# EAGLE design Motor_Surucu (EAGLE 9.6.2)
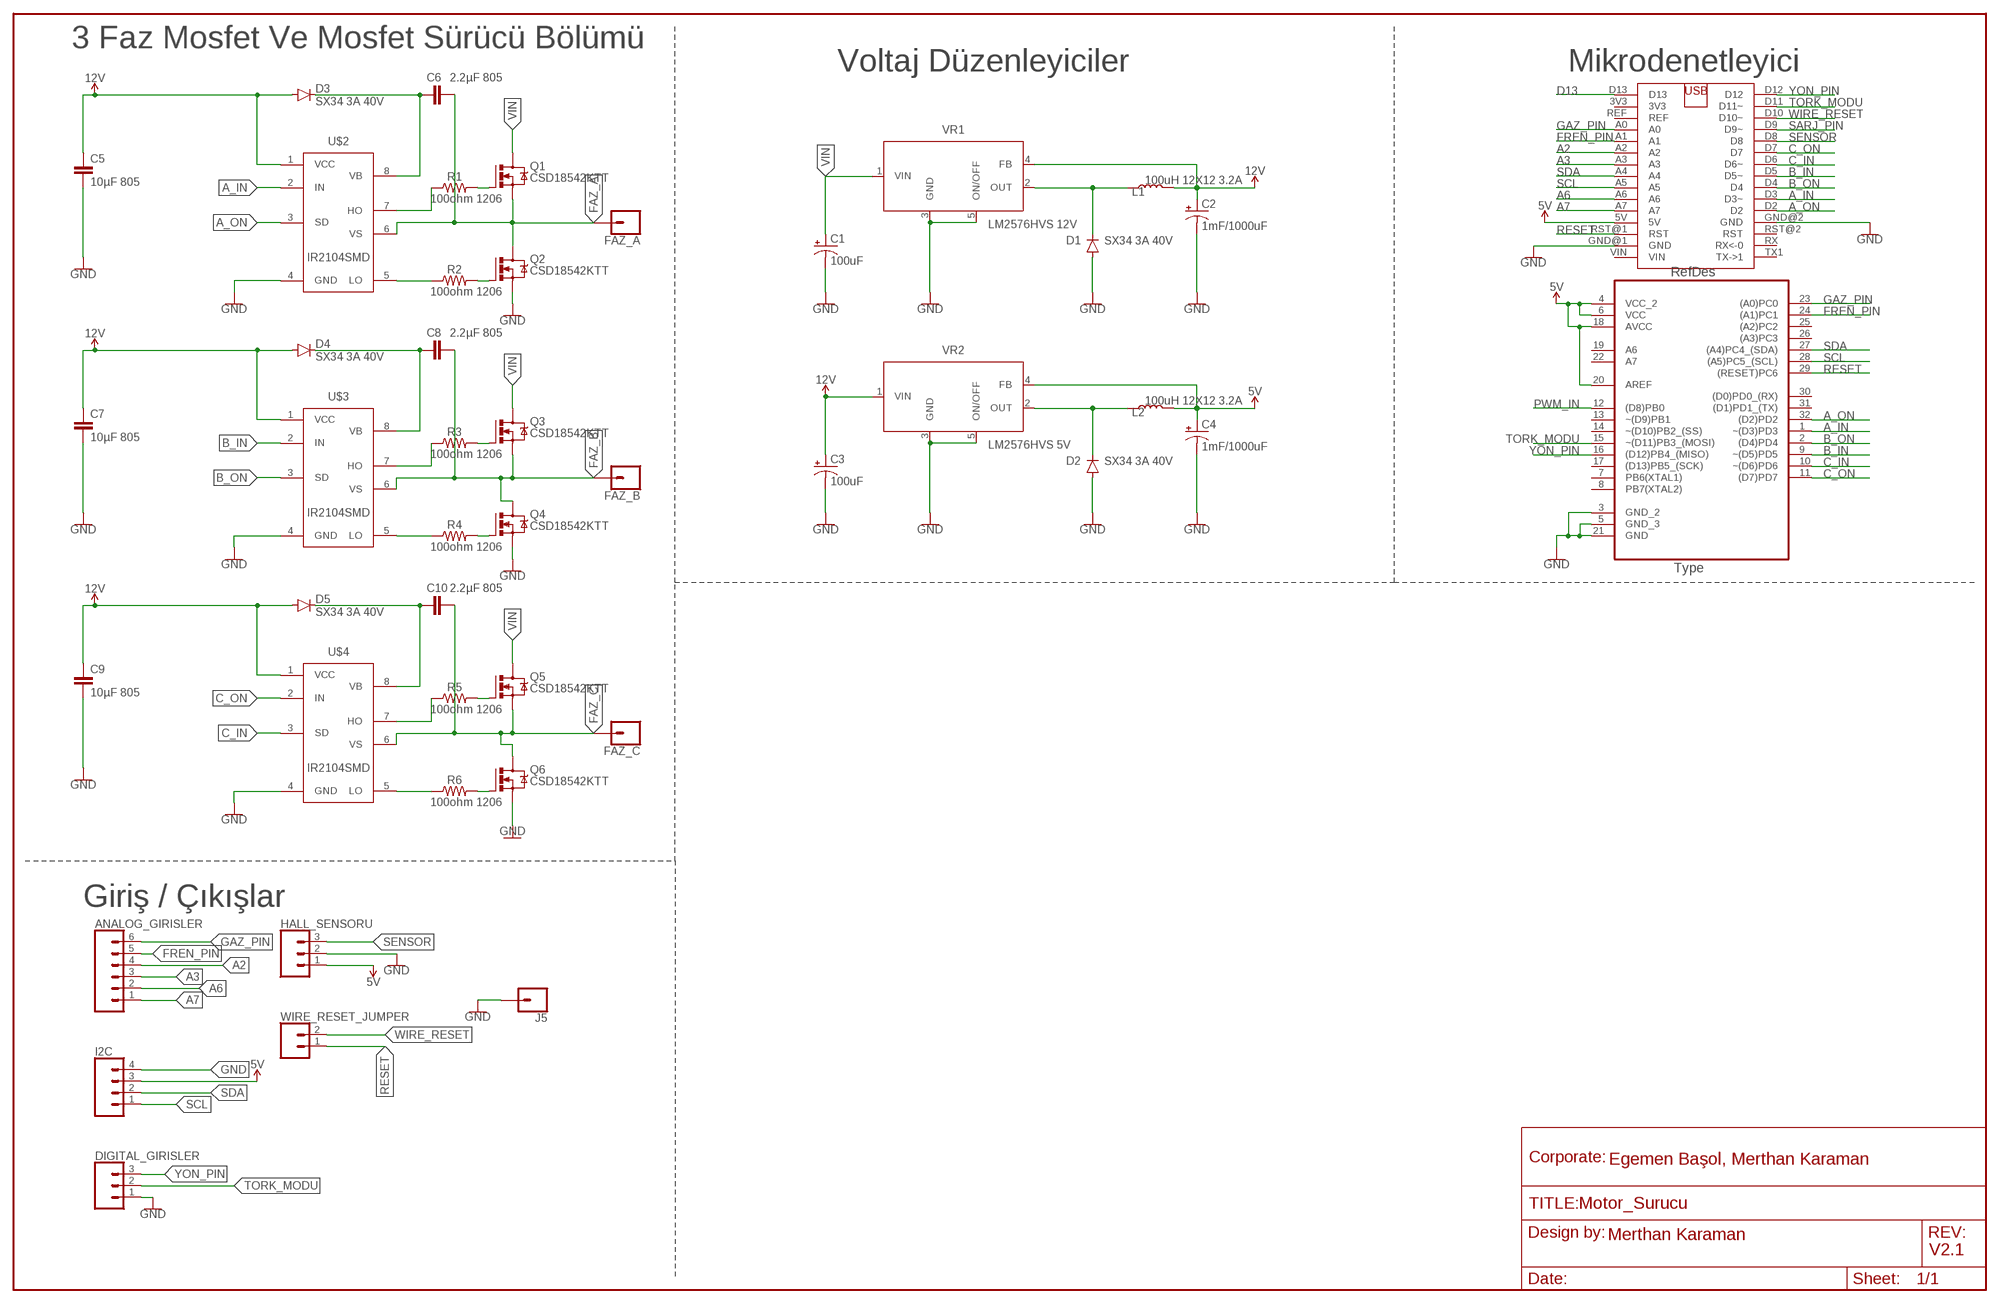
[diagram p0: schematic, sheet 1]
FRAME1 (FRAME-LEDGER): CORPO: Egemen Başol, Merthan Karaman; DESIGNER: Merthan Karaman; REV: V2.1

## Parts
ANALOG_GIRISLER  CONN_06LOCK  [1X06_LOCK]
C1  100uF  100UF-POLAR-RADIAL-2.5MM-25V-20%  [CPOL-RADIAL-2.5MM-6.5MM]
C2  1mF/1000uF  560UF-PANASONIC_G-25V-20%  [PANASONIC_G]
C3  100uF  100UF-POLAR-RADIAL-2.5MM-25V-20%  [CPOL-RADIAL-2.5MM-6.5MM]
C4  1mF/1000uF  560UF-PANASONIC_G-25V-20%  [PANASONIC_G]
C5  10µF 805  0.33UF/330NF-0805-50V-10%  [0805]
C6  2.2µF 805  0.33UF/330NF-0805-50V-10%  [0805]
C7  10µF 805  0.33UF/330NF-0805-50V-10%  [0805]
C8  2.2µF 805  0.33UF/330NF-0805-50V-10%  [0805]
C9  10µF 805  0.33UF/330NF-0805-50V-10%  [0805]
C10  2.2µF 805  0.33UF/330NF-0805-50V-10%  [0805]
D1  SX34 3A 40V  DIODE-DO214AC  [DO214AC]
D2  SX34 3A 40V  DIODE-DO214AC  [DO214AC]
D3  SX34 3A 40V  DIODE-DO214AC  [DO214AC]
D4  SX34 3A 40V  DIODE-DO214AC  [DO214AC]
D5  SX34 3A 40V  DIODE-DO214AC  [DO214AC]
DIGITAL_GIRISLER  CONN_03  [1X03]
FAZ_A  CONN_01SNAP-MALE  [SNAP-MALE]
FAZ_B  CONN_01SNAP-MALE  [SNAP-MALE]
FAZ_C  CONN_01SNAP-MALE  [SNAP-MALE]
HALL_SENSORU  CONN_03  [1X03]
I2C  CONN_04  [1X04]
J5  CONN_01SNAP-MALE  [SNAP-MALE]
L1  100uH 12X12 3.2A  INDUCTOR-SDR13-27UH  [INDUCTOR_SDR1307]
L2  100uH 12X12 3.2A  INDUCTOR-SDR13-27UH  [INDUCTOR_SDR1307]
Q1  CSD18542KTT  [TO263-3]
Q2  CSD18542KTT  [TO263-3]
Q3  CSD18542KTT  [TO263-3]
Q4  CSD18542KTT  [TO263-3]
Q5  CSD18542KTT  [TO263-3]
Q6  CSD18542KTT  [TO263-3]
R1  100ohm 1206  RESISTOR1206  [1206]
R2  100ohm 1206  RESISTOR1206  [1206]
R3  100ohm 1206  RESISTOR1206  [1206]
R4  100ohm 1206  RESISTOR1206  [1206]
R5  100ohm 1206  RESISTOR1206  [1206]
R6  100ohm 1206  RESISTOR1206  [1206]
U1  ATMEGA328P-AU  [QFP80P900X900X120-32N]
U$1  ARDUINO_NANO  [ARDUINO_NANO]
U$2  IR2104SMD  [SOIC-8]
U$3  IR2104SMD  [SOIC-8]
U$4  IR2104SMD  [SOIC-8]
VR1  LM2576HVS 12V  LM2576HVS-5.0/NOPBTO-263  [TO170P1435X465-6N]
VR2  LM2576HVS 5V  LM2576HVS-5.0/NOPBTO-263  [TO170P1435X465-6N]
WIRE_RESET_JUMPER  CONN_02  [1X02]

## Nets
5V: C4.+ HALL_SENSORU.1 I2C.3 L2.P$2 U1.4(VCC_2) U1.6(VCC) U1.18(AVCC) U1.20(AREF) U$1.5V VR2.4(FB)
12V: C2.+ C3.1(+) C5.1 C7.1 C9.1 D3.A D4.A D5.A L1.P$2 U$2.1(VCC) U$3.1(VCC) U$4.1(VCC) VR1.4(FB) VR2.1(VIN)
A2: ANALOG_GIRISLER.4 U$1.A2
A3: ANALOG_GIRISLER.3 U$1.A3
A6: ANALOG_GIRISLER.2 U$1.A6
A7: ANALOG_GIRISLER.1 U$1.A7
A_IN: U1.1(~(D3)PD3) U$1.D3(D3~) U$2.2(IN)
A_ON: U1.32((D2)PD2) U$1.D2 U$2.3(SD)
B_IN: U1.9(~(D5)PD5) U$1.D5(D5~) U$3.2(IN)
B_ON: U1.2((D4)PD4) U$1.D4 U$3.3(SD)
C_IN: U1.10(~(D6)PD6) U$1.D6(D6~) U$4.3(SD)
C_ON: U1.11((D7)PD7) U$1.D7 U$4.2(IN)
D13: U$1.D13
FAZ_A: C6.2 FAZ_A.2 Q1.3(S) Q2.TAB(D) U$2.6(VS)
FAZ_B: C8.2 FAZ_B.2 Q3.3(S) Q4.TAB(D) U$3.6(VS)
FAZ_C: C10.2 FAZ_C.2 Q5.3(S) Q6.TAB(D) U$4.6(VS)
FREN_PIN: ANALOG_GIRISLER.5 U1.24((A1)PC1) U$1.A1
GAZ_PIN: ANALOG_GIRISLER.6 U1.23((A0)PC0) U$1.A0
GND: C1.2(-) C2.- C3.2(-) C4.- C5.2 C7.2 C9.2 D1.A D2.A DIGITAL_GIRISLER.1 HALL_SENSORU.2 I2C.4 J5.2 Q2.3(S) Q4.3(S) Q6.3(S) U1.3(GND_2) U1.5(GND_3) U1.21(GND) U$1.GND@1(GND) U$1.GND@2(GND) U$2.4(GND) U$3.4(GND) U$4.4(GND) VR1.3(GND) VR1.5(ON/OFF) VR2.3(GND) VR2.5(ON/OFF)
N$1: D2.C L2.P$1 VR2.2(OUT)
N$4: C6.1 D3.C U$2.8(VB)
N$5: Q1.1(G) R1.2
N$6: R1.1 U$2.7(HO)
N$7: Q2.1(G) R2.2
N$8: R2.1 U$2.5(LO)
N$9: C8.1 D4.C U$3.8(VB)
N$10: Q3.1(G) R3.2
N$11: R3.1 U$3.7(HO)
N$12: Q4.1(G) R4.2
N$13: R4.1 U$3.5(LO)
N$14: C10.1 D5.C U$4.8(VB)
N$15: Q5.1(G) R5.2
N$16: R5.1 U$4.7(HO)
N$17: Q6.1(G) R6.2
N$18: R6.1 U$4.5(LO)
N$19: D1.C L1.P$1 VR1.2(OUT)
PWM_IN: U1.12((D8)PB0)
RESET: U1.29((RESET)PC6) U$1.RST@1(RST) WIRE_RESET_JUMPER.1
SARJ_PIN: U$1.D9(D9~)
SCL: I2C.1 U1.28((A5)PC5_(SCL)) U$1.A5
SDA: I2C.2 U1.27((A4)PC4_(SDA)) U$1.A4
SENSOR: HALL_SENSORU.3 U$1.D8
TORK_MODU: DIGITAL_GIRISLER.2 U1.15(~(D11)PB3_(MOSI)) U$1.D11(D11~)
VIN: C1.1(+) Q1.TAB(D) Q3.TAB(D) Q5.TAB(D) VR1.1(VIN)
WIRE_RESET: U$1.D10(D10~) WIRE_RESET_JUMPER.2
YON_PIN: DIGITAL_GIRISLER.3 U1.16((D12)PB4_(MISO)) U$1.D12
Unconnected: U1.7(PB6(XTAL1)) U1.8(PB7(XTAL2)) U1.13(~(D9)PB1) U1.14(~(D10)PB2_(SS)) U1.17((D13)PB5_(SCK)) U1.19(A6) U1.22(A7) U1.25((A2)PC2) U1.26((A3)PC3) U1.30((D0)PD0_(RX)) U1.31((D1)PD1_(TX)) U$1.3V3 U$1.REF U$1.RST@2(RST) U$1.RX(RX<-0) U$1.TX1(TX->1) U$1.VIN

## Notes on the sheet
- 3 Faz Mosfet Ve Mosfet Sürücü Bölümü
- Voltaj Düzenleyiciler | Mikrodenetleyici
- Giriş / Çıkışlar

## Library data of the parts
ANALOG_GIRISLER = SparkFun-Connectors:CONN_06: Multi connection point. Often used as Generic Header-pin footprint for 0.1 inch spaced/style header connections On any of the 0.1 inch spaced packages, you can populate with these: Break Away Headers - Straight <https://www.sparkfun.com/products/116> (PRT-00116) Break Away Male Headers - Right Angle <https://www.sparkfun.com/products/553> (PRT-00553) Female Headers <https://www.sparkfun.com/products/115> (PRT-00115) Break Away Headers - Machine Pin <https://www.sparkfun.com/products/117> (PRT-00117) Break Away Female Headers - Swiss Machine Pin <https://www.sparkfun.com/products/743> (PRT-00743) Arduino Stackable Header - 6 Pin <https://www.sparkfun.com/products/9280> (PRT-09280) For SCREWTERMINALS and SPRING TERMINALS visit here: Screw Terimnals on SparkFun.com <https://www.sparkfun.com/search/results?term=Screw+Terminals> (5mm/3.5mm/2.54mm spacing) This device is also useful as a general connection point to wire up your design to another part of your project. Our various solder wires solder well into these plated through hole pads. Hook-Up Wire - Assortment (Stranded, 22 AWG) <https://www.sparkfun.com/products/11375> (PRT-11375) Hook-Up Wire - Assortment (Solid Core, 22 AWG) <https://www.sparkfun.com/products/11367> (PRT-11367) View the entire wire category on our website here <https://www.sparkfun.com/categories/141>
C1 C3 = SparkFun-Capacitors:100UF-POLAR: 100µF polarized capacitors A capacitor is a passive two-terminal electrical component used to store electrical energy temporarily in an electric field.; PROD_ID: CAP-08439
C2 C4 = SparkFun-Capacitors:560UF: 560µF polarized capacitors A capacitor is a passive two-terminal electrical component used to store electrical energy temporarily in an electric field.; PROD_ID: CAP-09983; VALUE: 560uF
C5-C10 = SparkFun-Capacitors:0.33UF/330NF: 0.33µF/330nF ceramic capacitors A capacitor is a passive two-terminal electrical component used to store electrical energy temporarily in an electric field.; PROD_ID: CAP-08469; VALUE: 0.33µF
D1-D5 = diode:DIODE-: DIODE
DIGITAL_GIRISLER HALL_SENSORU = SparkFun-Connectors:CONN_03: Multi connection point. Often used as Generic Header-pin footprint for 0.1 inch spaced/style header connections On any of the 0.1 inch spaced packages, you can populate with these: Break Away Headers - Straight <https://www.sparkfun.com/products/116> (PRT-00116) Break Away Male Headers - Right Angle <https://www.sparkfun.com/products/553> (PRT-00553) Female Headers <https://www.sparkfun.com/products/115> (PRT-00115) Break Away Headers - Machine Pin <https://www.sparkfun.com/products/117> (PRT-00117) Break Away Female Headers - Swiss Machine Pin <https://www.sparkfun.com/products/743> (PRT-00743) Stackable Header - 3 Pin (Female, 0.1") <https://www.sparkfun.com/products/13875> (PRT-13875) For SCREWTERMINALS and SPRING TERMINALS visit here: Screw Terimnals on SparkFun.com <https://www.sparkfun.com/search/results?term=Screw+Terminals> (5mm/3.5mm/2.54mm spacing) This device is also useful as a general connection point to wire up your design to another part of your project. Our various solder wires solder well into these plated through hole pads. Hook-Up Wire - Assortment (Stranded, 22 AWG) <https://www.sparkfun.com/products/11375> (PRT-11375) Hook-Up Wire - Assortment (Solid Core, 22 AWG) <https://www.sparkfun.com/products/11367> (PRT-11367) View the entire wire category on our website here <https://www.sparkfun.com/categories/141> Special notes: Molex polarized connector foot print use with SKU : PRT-08232 with associated crimp pins and housings.
FAZ_A FAZ_B FAZ_C J5 = SparkFun-Connectors:CONN_01: Single connection point. Often used as Generic Header-pin footprint for 0.1 inch spaced/style header connections On any of the 0.1 inch spaced packages, you can populate with these: Break Away Headers - Straight <https://www.sparkfun.com/products/116> (PRT-00116) Break Away Male Headers - Right Angle <https://www.sparkfun.com/products/553> (PRT-00553) Female Headers <https://www.sparkfun.com/products/115> (PRT-00115) Break Away Headers - Machine Pin <https://www.sparkfun.com/products/117> (PRT-00117) Break Away Female Headers - Swiss Machine Pin <https://www.sparkfun.com/products/743> (PRT-00743) This device is also useful as a general connection point to wire up your design to another part of your project. Our various solder wires solder well into these plated through hole pads. Hook-Up Wire - Assortment (Stranded, 22 AWG) <https://www.sparkfun.com/products/11375> (PRT-11375) Hook-Up Wire - Assortment (Solid Core, 22 AWG) <https://www.sparkfun.com/products/11367> (PRT-11367) View the entire wire category on our website here <https://www.sparkfun.com/categories/141> Special notes: SMTSO-256-ET is a "flush mount" nut for a 4-40 screw. We mostly use this on specialty testbeds; it is a nice way to connect hardware to your PCB at an adjustable hieght. Also note, the SNAP packages are for using a snappable style connector. We sell a baggie of snaps and they are also used on two LilyPad designs: Snap Assortment - 30 pack (male and female) <https://www.sparkfun.com/products/11347> (DEV-11347) LilyPad Arduino SimpleSnap <https://www.sparkfun.com/products/10941> (DEV-10941) LilyPad SimpleSnap Protoboard <https://www.sparkfun.com/products/10940> (DEV-10940)
I2C = SparkFun-Connectors:CONN_04: Multi connection point. Often used as Generic Header-pin footprint for 0.1 inch spaced/style header connections On any of the 0.1 inch spaced packages, you can populate with these: Break Away Headers - Straight <https://www.sparkfun.com/products/116> (PRT-00116) Break Away Male Headers - Right Angle <https://www.sparkfun.com/products/553> (PRT-00553) Female Headers <https://www.sparkfun.com/products/115> (PRT-00115) Break Away Headers - Machine Pin <https://www.sparkfun.com/products/117> (PRT-00117) Break Away Female Headers - Swiss Machine Pin <https://www.sparkfun.com/products/743> (PRT-00743) For SCREWTERMINALS and SPRING TERMINALS visit here: Screw Terimnals on SparkFun.com <https://www.sparkfun.com/search/results?term=Screw+Terminals> (5mm/3.5mm/2.54mm spacing) This device is also useful as a general connection point to wire up your design to another part of your project. Our various solder wires solder well into these plated through hole pads. Hook-Up Wire - Assortment (Stranded, 22 AWG) <https://www.sparkfun.com/products/11375> (PRT-11375) Hook-Up Wire - Assortment (Solid Core, 22 AWG) <https://www.sparkfun.com/products/11367> (PRT-11367) View the entire wire category on our website here <https://www.sparkfun.com/categories/141> Special notes: Molex polarized connector foot print use with SKU : PRT-08231 with associated crimp pins and housings. 1MM SMD Version SKU: PRT-10208; PROD_ID: CONN-09696
L1 L2 = SparkFun-Coils:INDUCTOR: Inductors Resist changes in electrical current. Basically a coil of wire. SparkFun Products: SparkFun Load Cell Amplifier - HX711 <https://www.sparkfun.com/products/13879> IOIO-OTG - V2.2 <https://www.sparkfun.com/products/13613>; PROD_ID: NDUC-12529; VALUE: 27µH/±20%/3.3A
Q1-Q6 = El_yapimi:CSD18542KTT
R1-R6 = SparkFun-Resistors:RESISTOR: Generic Resistor Package
U1 = El_yapimi:ATMEGA328P-AU; DESCRIPTION: 8-bit Microcontroller with In-System Programmable Flash; MPN: ATMEGA328P-AU; OC_FARNELL: 1715486; OC_NEWARK: 14R4631; PACKAGE: TQFP-32; SUPPLIER: Atmel
U$1 = El_yapimi:ARDUINO_NANO
U$2-U$4 = El_yapimi:IR2104SMD
VR1 VR2 = IC_Power-Management:LM2576HVS-5.0/NOPB: SIMPLE SWITCHER® 3-A Step-Down Voltage Regulator Datasheet <http://www.ti.com/lit/ds/symlink/lm2576hv.pdf>; CATEGORY: IC_Power-Management; MANUFACTURER: TI; MPN: LM2576HVS-5.0/NOPB; OPERATING_TEMP: -40 to +125 °C; PART_STATUS: Active; ROHS_COMPLIANT: Non Compliant; SERIES: LM2576xx; SUB-CATEGORY: Voltage Regulator; TYPE: DC-DC Switching; VALUE: LM2576HVS
WIRE_RESET_JUMPER = SparkFun-Connectors:CONN_02: Multi connection point. Often used as Generic Header-pin footprint for 0.1 inch spaced/style header connections On any of the 0.1 inch spaced packages, you can populate with these: Break Away Headers - Straight <https://www.sparkfun.com/products/116> (PRT-00116) Break Away Male Headers - Right Angle <https://www.sparkfun.com/products/553> (PRT-00553) Female Headers <https://www.sparkfun.com/products/115> (PRT-00115) Break Away Headers - Machine Pin <https://www.sparkfun.com/products/117> (PRT-00117) Break Away Female Headers - Swiss Machine Pin <https://www.sparkfun.com/products/743> (PRT-00743) For SCREWTERMINALS and SPRING TERMINALS visit here: Screw Terimnals on SparkFun.com <https://www.sparkfun.com/search/results?term=Screw+Terminals> (5mm/3.5mm/2.54mm spacing) This device is also useful as a general connection point to wire up your design to another part of your project. Our various solder wires solder well into these plated through hole pads. Hook-Up Wire - Assortment (Stranded, 22 AWG) <https://www.sparkfun.com/products/11375> (PRT-11375) Hook-Up Wire - Assortment (Solid Core, 22 AWG) <https://www.sparkfun.com/products/11367> (PRT-11367) View the entire wire category on our website here <https://www.sparkfun.com/categories/141> Special notes: Molex polarized connector foot print use with: PRT-08233 with associated crimp pins and housings. 2.54_SCREWTERM for use with PRT-10571. 3.5mm Screw Terminal footprints for PRT-08084 5mm Screw Terminal footprints for use with PRT-08432

## Board
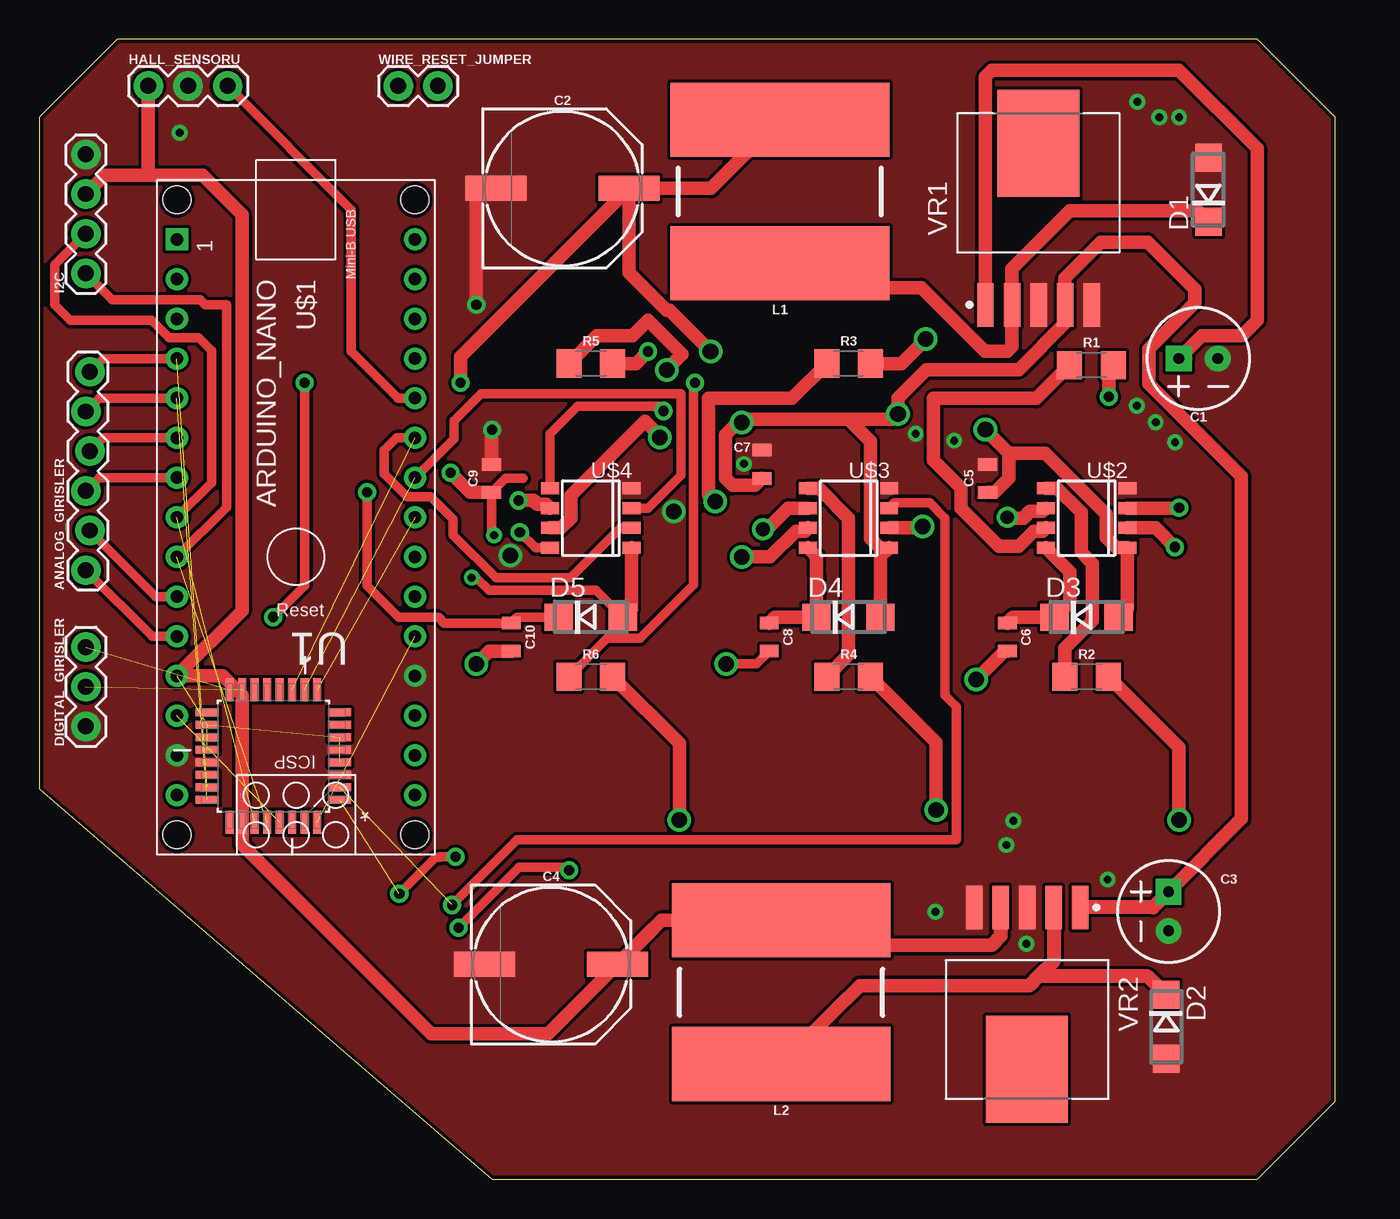
[diagram p1: board, top side]
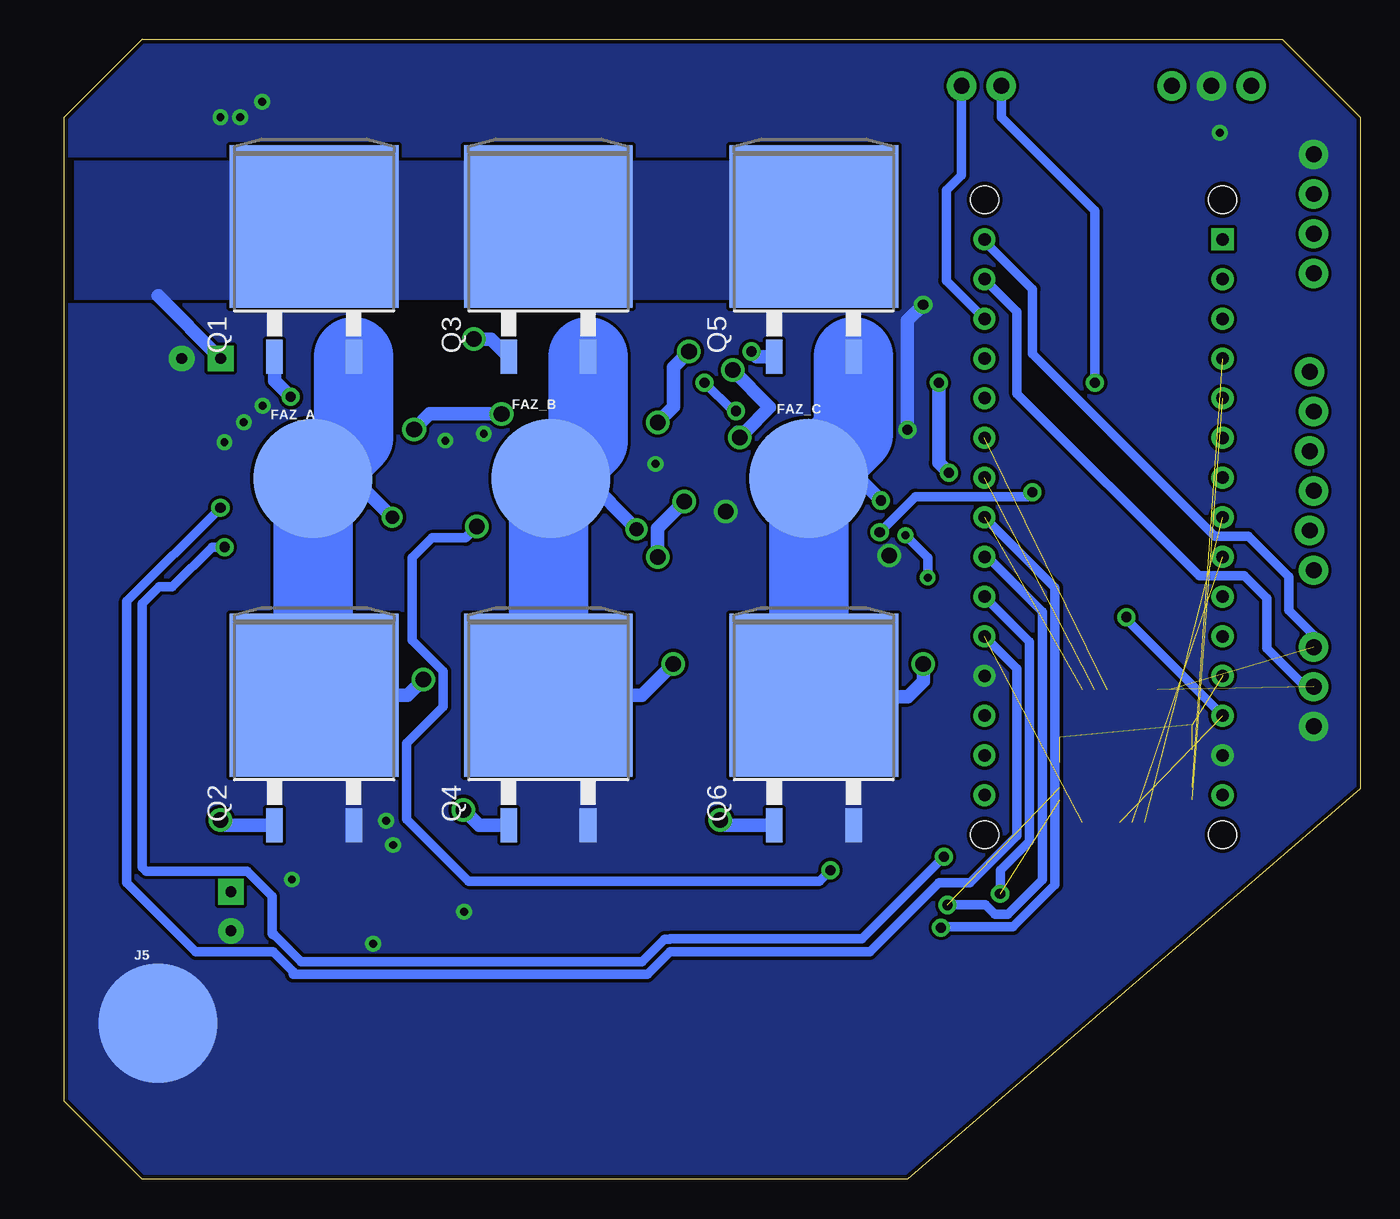
[diagram p2: board, bottom side, seen from below]

Size 83 x 73 mm. Coordinates in mm from the lower left corner, seen from the top.
Outline: 78,73 5,73 0,68 0,25 29,0 78,0 83,5 83,68 78,73
Copper layers (1*16): Top 0.035mm / dielectric 1.5mm / Bottom 0.035mm
Design rules "SparkFun": minimum track width 8mil, minimum drill 20mil, track to track 8mil, track to pad 8mil, pad to pad 8mil, via to via 8mil, smd to smd 8mil, copper to edge 10mil, drill to drill 8mil, minimum pad ring 12mil, minimum via ring 10mil, stop-mask expansion 4mil, vias tented up to drill 25mil, thermal gap 10mil

### Footprints (pad centres in the part's own frame; a part is rotated, then mirrored left to right if it is on the bottom)
1X06_LOCK = drill 1.016 pad 1.88: 1 0,0; 2 2.54,-0.254; 3 5.08,0; 4 7.62,-0.254; 5 10.16,0; 6 12.7,-0.254
CPOL-RADIAL-2.5MM-6.5MM = drill 0.7 pad 1.651 square: 1 1.25,0 | drill 0.7 pad 1.651: 2 -1.25,0
PANASONIC_G = smd 3.9 x 1.6: + 4.25,0; - -4.25,0
0805 = smd 0.8 x 1.2: 1 -0.9,0; 2 0.9,0
DO214AC = smd 1.8 x 1.7: A 2.05,0; C -2.05,0
1X03 = drill 1.016 pad 1.88: 1 0,0; 2 2.54,0; 3 5.08,0
SNAP-MALE = smd 7.62 x 7.62: 2 0,0
1X04 = drill 1.016 pad 1.88: 1 0,0; 2 2.54,0; 3 5.08,0; 4 7.62,0
INDUCTOR_SDR1307 = smd 14 x 4.75: P$1 0,4.6; P$2 0,-4.6
TO263-3 = smd 1.067 x 2.159: 1 -2.54,-8.331; 3 2.54,-8.331 | smd 10.8 x 10.41: TAB 0,0
1206 = smd 1.6 x 1.8: 1 -1.4,0; 2 1.4,0
QFP80P900X900X120-32N = smd 1.473 x 0.508: 1 -4.242,2.794; 2 -4.242,2.007; 3 -4.242,1.194; 4 -4.242,0.406; 5 -4.242,-0.406; 6 -4.242,-1.194; 7 -4.242,-2.007; 8 -4.242,-2.794; 17 4.242,-2.794; 18 4.242,-2.007; 19 4.242,-1.194; 20 4.242,-0.406; 21 4.242,0.406; 22 4.242,1.194; 23 4.242,2.007; 24 4.242,2.794 | smd 0.508 x 1.473: 9 -2.794,-4.242; 10 -2.007,-4.242; 11 -1.194,-4.242; 12 -0.406,-4.242; 13 0.406,-4.242; 14 1.194,-4.242; 15 2.007,-4.242; 16 2.794,-4.242; 25 2.794,4.242; 26 2.007,4.242; 27 1.194,4.242; 28 0.406,4.242; 29 -0.406,4.242; 30 -1.194,4.242; 31 -2.007,4.242; 32 -2.794,4.242
ARDUINO_NANO = drill 0.8: 3V3 -7.62,13.97; 5V -7.62,-11.43; A0 -7.62,8.89; A1 -7.62,6.35; A2 -7.62,3.81; A3 -7.62,1.27; A4 -7.62,-1.27; A5 -7.62,-3.81; A6 -7.62,-6.35; A7 -7.62,-8.89; D2 7.62,-8.89; D3 7.62,-6.35; D4 7.62,-3.81; D5 7.62,-1.27; D6 7.62,1.27; D7 7.62,3.81; D8 7.62,6.35; D9 7.62,8.89; D10 7.62,11.43; D11 7.62,13.97; D12 7.62,16.51; GND@1 -7.62,-16.51; GND@2 7.62,-11.43; REF -7.62,11.43; RST@1 -7.62,-13.97; RST@2 7.62,-13.97; RX 7.62,-16.51; TX1 7.62,-19.05; VIN -7.62,-19.05 | drill 0.8 square: D13 -7.62,16.51 | hole 1.778: -7.62,19.05; 7.62,19.05; 7.62,-21.59; -7.62,-21.59
SOIC-8 = smd 0.762 x 1.143: 1 -1.905,-2.6; 2 -0.635,-2.6; 3 0.635,-2.6; 4 1.905,-2.6; 5 1.905,2.6; 6 0.635,2.6; 7 -0.635,2.6; 8 -1.905,2.6
TO170P1435X465-6N = smd 2.792 x 1.053: 1 -6.185,3.4; 2 -6.185,1.7; 3 -6.185,0; 4 -6.185,-1.7; 5 -6.185,-3.4 | smd 6.842 x 5.252: 6 4.16,0
1X02 = drill 1.016 pad 1.88: 1 0,0; 2 2.54,0

### Placement (x,y rotation side)
ANALOG_GIRISLER  3,39 90 top
C1  74.24,52.55 180 top
C2  33.52,63.44 0 top
C3  72.33,17.16 90 top
C4  32.79,13.77 0 top
C5  60.73,44.88 90 top
C6  62,34.72 270 top
C7  46.29,45.78 90 top
C8  46.76,34.72 270 top
C9  28.98,44.88 90 top
C10  30.25,34.72 270 top
D1  74.89,63.36 90 top
D2  72.16,9.78 270 top
D3  67.08,35.99 0 top
D4  51.84,35.99 0 top
D5  35.33,35.99 0 top
DIGITAL_GIRISLER  3,29 90 top
FAZ_A  67.08,44.88 0 bottom
FAZ_B  51.84,44.88 0 bottom
FAZ_C  35.33,44.88 0 bottom
HALL_SENSORU  7,70 0 top
I2C  3,58 90 top
J5  77,10 0 bottom
L1  47.44,63.24 180 top
L2  47.52,11.99 180 top
Q1  67,61 0 bottom
Q2  67,31 0 bottom
Q3  52,61 0 bottom
Q4  52,31 0 bottom
Q5  35,61 0 bottom
Q6  35,31 0 bottom
R1  67.38,52.13 0 top
R2  67.08,32.18 0 top
R3  51.84,52.23 0 top
R4  51.84,32.18 0 top
R5  35.33,52.23 0 top
R6  35.33,32.18 0 top
U1  15.01,27.1 180 top
U$1  16.45,43.66 0 top
U$2  67.08,42.34 90 top
U$3  51.84,42.34 90 top
U$4  35.33,42.34 90 top
VR1  64,62.17 90 top
VR2  63.27,11.23 270 top
WIRE_RESET_JUMPER  23,70 0 top

### Tracks (layer width: path | path; a pad name or v marks a point on that pad's centre or on a via)
5V  (4 unrouted)
  Top 0.864: 7,64.28 4.2,64.28 I2C.3 | 7,64.28 10.48,64.28 13,61.77 13,36.4 U$1.5V 11.77,32.23 13,31 13,21.44 25.12,9.32 32.58,9.32 C4.+ | HALL_SENSORU.1 7,64.28 | 61,15 49.11,15 L2.P$2 39.85,16.59 39.26,16
  Top 0.889: VR2.4 61.57,15.57 61,15 | C4.+ 37.77,14.5 39.26,16
12V  (via drill 0.51, 0.65, 1)
  Top 0.61: 31,44.88 29.88,44.88 C9.1 28.98,41.4 v29.14,41.23 | v27.71,38.53 27.99,38.53 28.82,37.7 35.67,37.7 D5.A
  Top 0.864: L1.P$2 43.04,63.44 C2.+ | C2.+ 27,52.67 v27,51 | v26.36,45.23 27.61,43.98 C9.1 | v43,53 40.37,55.63 40.18,55.63 37.77,58.04 C2.+ | 51.84,48.66 54.66,48.66 v55,49 55,50 56.84,51.84 62.74,51.84 65.7,54.8 VR1.4 65.7,57.7 68,60 71,60 74,57 74,56.11 71.07,53.18 71.07,50.93 77,45 77,23.08 C3.1 | 51.84,48.66 45.2,48.66 v45,48.46 44.75,48.46 43.96,47.67 43.96,44.87 44.4,44.43 45.84,44.43 C7.1 | 62.1,46.5 62.1,44.88 61.2,43.98 C5.1 | v60.6,48 62.1,46.5 | 62.1,46.5 64.44,46.5 68.35,42.59 68.35,41.07 68.99,40.44 U$2.1 69.68,36.54 D3.A | D4.A 53.89,39.88 | 53.89,39.88 U$3.1 | 53.89,39.88 53.89,40.4 53.23,41.06 53.23,47.27 51.84,48.66 | D5.A 37.93,36.54 U$4.1
  Top 0.889: C3.1 71.34,17.43 VR2.1
  Bottom 0.61: v27.71,38.53 27.71,39.8 v29.14,41.23
  Bottom 0.864: v27,51 27,45.87 v26.36,45.23 | v43,53 44,52 44,49.46 v45,48.46 | v55,49 59.6,49 v60.6,48
A2
  Top 0.61: ANALOG_GIRISLER.4 4.1,47.47 U$1.A2
A3
  Top 0.61: ANALOG_GIRISLER.3 3.85,44.93 U$1.A3
A6
  Top 0.61: ANALOG_GIRISLER.2 7.48,37.31 U$1.A6
A7
  Top 0.61: ANALOG_GIRISLER.1 7.23,34.77 U$1.A7
A_IN  (via drill 0.65)  (1 unrouted)
  Top 0.61: v23.07,18.29 25.4,20.62 25.67,20.62 25.7,20.65 v26.68,20.65
  Top 0.864: U$2.2 71.51,41.7 v72.74,40.48
  Bottom 0.61: v26.68,20.65 31.94,15.4 44.22,15.4 44.23,15.39 44.56,15.39 46,13.94 67.84,13.94 69.56,15.67 69.62,15.67 69.69,15.74 69.69,18.14 71.29,19.74 77.74,19.74 78,20 78,36.85 76.93,37.92 76.07,37.92 73.52,40.48 v72.74,40.48 | v23.07,18.29 23.07,19.78 21.19,21.66 21.19,34.43 U$1.D3
A_ON  (via drill 0.65)  (1 unrouted)
  Top 0.864: v73,43 72.97,42.98 U$2.3
  Bottom 0.61: v73,43 79,37 79,19 74.58,14.58 69.62,14.58 68.35,13.31 68.35,13.13 45.67,13.13 44.22,14.58 31.42,14.58 27,19 25,19 22,22 22,32.7 U$1.D2
B_IN  (via drill 0.65, 1)  (1 unrouted)
  Top 0.61: v26.86,16.12 30.74,20 33.94,20 v33.94,19.8
  Top 0.864: U$3.2 56.5,41.7 v56.58,41.79
  Bottom 0.61: U$1.D5 19.56,37.88 19.56,18.85 22.24,16.17 26.81,16.17 v26.86,16.12 | v33.94,19.8 34.65,19.09 57.11,19.09 61.07,23.05 61.07,27.93 58.74,30.26 58.74,32.52 60.73,34.52 60.73,39.8 59.46,41.07 57.3,41.07 v56.58,41.79
B_ON  (via drill 0.65)  (1 unrouted)
  Top 0.61: v26.44,17.57 30.61,21.74 58.73,21.74 58.73,30.27 58.02,30.98 58.02,42.34 57.05,43.3 54.77,43.3 U$3.3
  Bottom 0.61: U$1.D4 23.89,39.85 20.37,36.33 20.37,19.19 22.58,16.98 23.42,16.98 24.01,17.57 v26.44,17.57
C_IN  (1 unrouted)
  Top 0.61: U$1.D6 26.57,47.43 26.57,48.57 28.3,50.3 41.1,50.3 41.1,45.09 38.99,42.98 U$4.3
C_ON  (1 unrouted)
  Top 0.61: U$1.D7 22.89,47.47 22.1,46.68 22.1,45.18 23.57,43.72 25.06,43.72 26.52,42.26 26.52,41.25 29.25,38.52 34.05,38.52 37.23,41.7 U$4.2
FAZ_A  (via drill 0.85, 1)
  Top 0.61: 62.05,42.34 v62,42.39
  Top 0.864: C6.2 61.82,33.82 v60,32 | U$2.6 64.28,42.77 63.46,42.77 63.03,42.34 62.05,42.34
  Bottom 0.864: FAZ_A.2 64.49,44.88 v62,42.39 | Q2.TAB 61,31 v60,32
  Bottom 5.08: Q1.3 64.46,47.5 FAZ_A.2 67.08,31.08 Q2.TAB
FAZ_B  (via drill 0.9, 1)
  Top 0.61: C8.2 45.94,33 v44,33
  Top 0.864: v46.35,41.63 46.62,41.63 47.97,42.98 U$3.6
  Bottom 0.864: FAZ_B.2 49.61,44.88 v46.35,41.63 | Q4.TAB 46,31 v44,33
  Bottom 5.08: Q3.3 49.46,47.26 FAZ_B.2 52,44.72 Q4.TAB
FAZ_C  (via drill 0.65, 1)
  Top 0.864: C10.2 28.82,33.82 v28,33 | v30.71,43.46 31.66,43.46 31.89,43.23 32.48,43.23 U$4.6
  Bottom 0.864: FAZ_C.2 32.12,44.88 v30.71,43.46 | Q6.TAB 34.91,30.91 28.98,30.91 28,31.89 v28,33
  Bottom 5.08: Q6.TAB 35.33,31.33 FAZ_C.2 32.46,47.75 Q5.3
FREN_PIN  (1 unrouted)
  Top 0.61: ANALOG_GIRISLER.5 3.85,50.01 U$1.A1
GAZ_PIN  (1 unrouted)
  Top 0.61: ANALOG_GIRISLER.6 4.1,52.55 U$1.A0
GND  (via drill 0.51, 0.65, 1)
  Top 0.864: C9.2 28.98,47.98 v29,48 | v28,56 28,63
  Bottom 0.864: v29,48 29,55 v28,56
  other vias: 58.6,47.3 40.65,42.75 73,68 9,67 45.15,45.8 56.13,47.72 61.95,21.41 62.38,22.96 68.43,19.2 71.73,68 70.33,68.98 57.4,17.14 63.22,15.09 70.31,49.53 71.5,48.46 72.74,47.19 30.19,39.93
  pour Top (rank 3, no thermals): -10.85,78.3 -10.85,-2.7 89.21,-2.7 89.21,78.3
  pour Bottom (rank 3, no thermals): -15.01,82 -15,-6 93,-6 93.01,82
N$1
  Top 0.864: 63.42,12.42 52.56,12.42 51.72,11.58 L2.P$1
  Top 0.889: VR2.2 64.97,13.97 64,13 | 64,13 63.42,12.42 | D2.C 70.99,13 64,13
N$4
  Top 0.864: C6.1 62.37,35.99 D3.C 66,36.96 66,38.91 U$2.8
N$5  (via drill 0.65)
  Top 0.864: R1.2 68.5,51.85 v68.5,50.1
  Bottom 0.864: v68.5,50.1 69.54,51.14 Q1.1
N$6
  Top 0.864: R1.1 63.85,50 57.28,50 57.28,46.05 59.04,44.29 59.04,42.96 61.47,40.53 62.73,40.53 63.7,41.5 64.28,41.5 U$2.7
N$7  (via drill 1)
  Top 0.864: R2.2 73,27.66 v73,23
  Bottom 0.864: v73,23 72.67,22.67 Q2.1
N$8
  Top 0.864: U$2.5 65.18,44.24 66.73,42.7 66.73,40.15 67.46,39.42 67.46,35.77 65.68,33.99 R2.1
N$9
  Top 0.864: C8.1 47.13,35.99 D4.C 49.79,38.53 49.79,38.67 49.79,39.88 U$3.8
N$10  (via drill 1)
  Top 0.864: R3.2 55.21,52.23 v56.78,53.8
  Bottom 0.864: v56.78,53.8 55.67,53.8 Q3.1
N$11  (via drill 1)
  Top 0.864: R3.1 48.21,50 42.87,50 42.87,43.83 v43.3,43.4 | U$3.7 49.04,41.5 48.46,41.5 46.8,39.85 v45,39.85
  Bottom 0.864: v43.3,43.4 45,41.7 v45,39.85
N$12  (via drill 1)
  Top 0.864: R4.2 57.44,27.98 v57.44,23.66
  Bottom 0.864: v57.44,23.66 56.45,22.67 Q4.1
N$13
  Top 0.864: R4.1 51.78,33.52 51.84,33.58 51.84,42.34 49.94,44.24 U$3.5
N$14  (via drill 0.65)
  Top 0.61: D5.C 30.62,35.99 C10.1 25.94,35.62 25.57,35.98 23.02,35.98 21,38 v21,44 | U$4.8 31.79,40.44 v30.79,41.44
  Bottom 0.61: v21,44 21.28,43.72 28.51,43.72 v30.79,41.44
N$15  (via drill 0.65)
  Top 0.864: R5.2 38.23,52.23 v39,53
  Bottom 0.864: v39,53 38.67,52.67 Q5.1
N$16  (via drill 1)
  Top 0.864: R5.1 35.7,54 38,54 39,55 41.19,52.81 v40.19,51.82 | v39.75,47.51 39.75,47.59 38.8,48.54 34.06,43.81 34.06,42.34 33.42,41.7 U$4.7
  Bottom 0.864: v40.19,51.82 40.19,51.79 37.83,49.43 39.43,47.84 39.89,47.84 39.75,47.7 v39.75,47.51
N$17  (via drill 1)
  Top 0.864: R6.2 41,27.91 v41,23
  Bottom 0.864: v41,23 40.67,22.67 Q6.1
N$18  (via drill 0.65)
  Top 0.61: R6.1 36.38,34.63 38.49,34.63 41.92,38.06 41.92,50.92 v42,51 | v39.99,49.19 39.7,49.48 34.47,49.48 32.73,47.74 U$4.5
  Bottom 0.61: v42,51 40.19,49.19 v39.99,49.19
N$19
  Top 0.864: D1.C 74.2,62 66,62 62.3,58.3 VR1.2 62.3,53.3 62,53 60.58,53 56.49,57.09 48.99,57.09 L1.P$1
RESET  (via drill 0.65)  (1 unrouted)
  Top 0.61: v17,51 17,38 v15,36
  Bottom 0.61: WIRE_RESET_JUMPER.1 23,68 17,62 v17,51 | v15,36 15,35.86 U$1.RST@1
SCL  (1 unrouted)
  Top 0.61: I2C.1 4.7,56.3 10.33,56.3 10.64,56 12,56 12,43.02 U$1.A5
SDA  (1 unrouted)
  Top 0.61: U$1.A4 11.04,44.6 11.04,53.05 10.22,53.88 8.33,53.88 7.2,55 2,55 1,56 1,58.54 I2C.2
SENSOR
  Top 0.61: HALL_SENSORU.3 20,62.08 20,53 22.99,50.01 U$1.D8
TORK_MODU  (1 unrouted)
  Bottom 0.61: U$1.D11 22,55.56 22,50.3 10.33,38.64 7.44,38.64 6,37.2 6,34 3.54,31.54 DIGITAL_GIRISLER.2
VIN
  Top 0.864: VR1.1 60.6,70.6 61,71 73,71 78,66 78,55 77.01,54.01 74.45,54.01 C1.1 73.43,52.55
  Bottom 0.864: C1.1 77,56.56
  pour Bottom (no thermals): 30.25,65.2 30.25,56.31 82.32,56.31 82.32,65.2
WIRE_RESET
  Bottom 0.61: WIRE_RESET_JUMPER.2 25.54,64.29 26.52,63.31 26.52,57.54 U$1.D10
YON_PIN  (1 unrouted)
  Bottom 0.61: DIGITAL_GIRISLER.3 3,34.84 4.58,36.42 4.58,38.58 7.18,41.18 9.33,41.18 21,52.84 21,57 24.07,60.07 U$1.D12